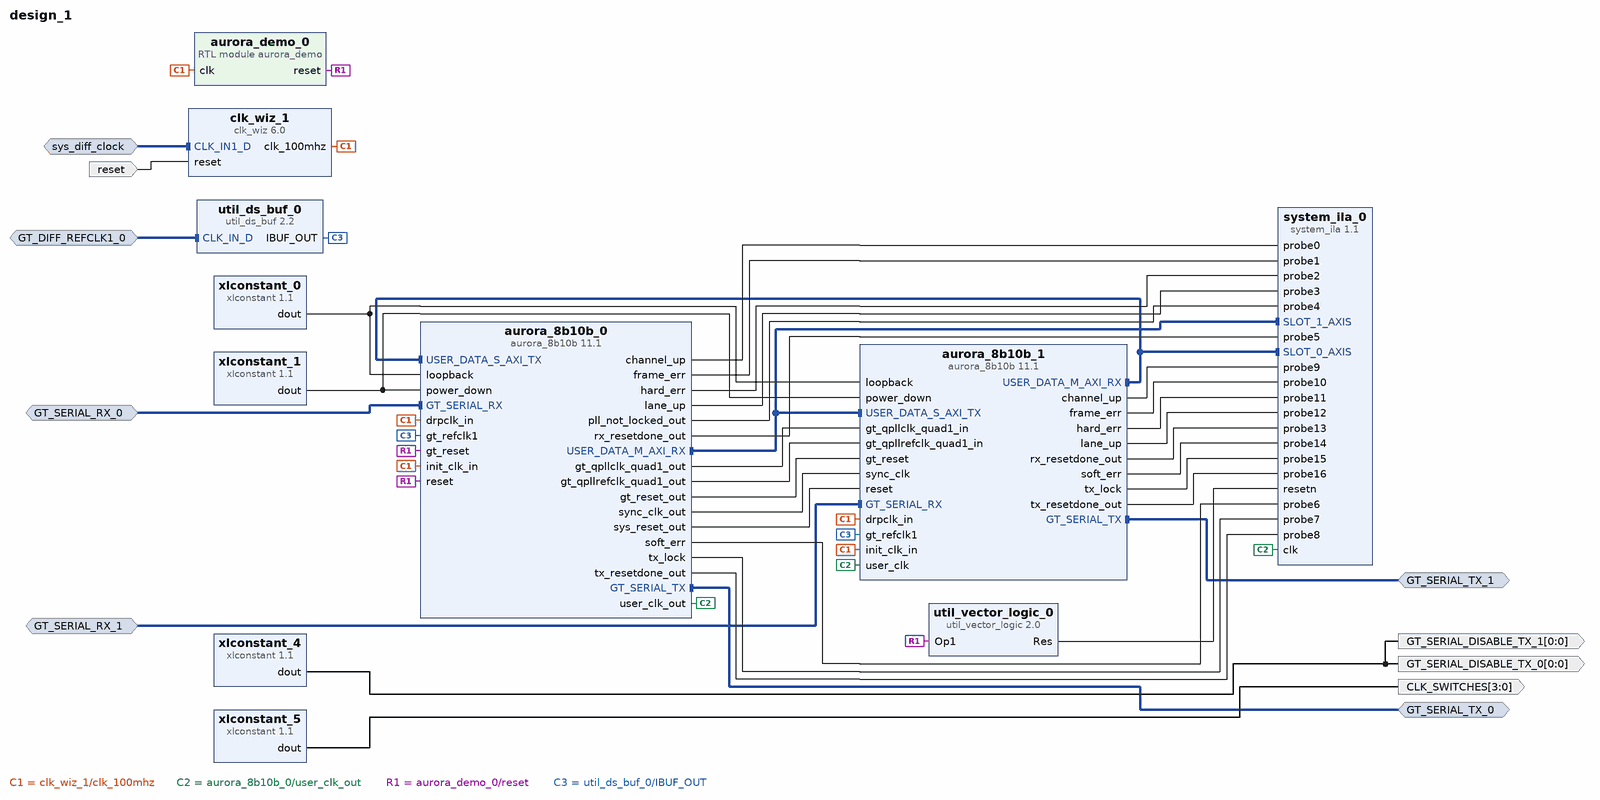
[diagram p0: block diagram of the top level]
# Vivado block design design_1, xc7vx485tffg1761-2, Vivado 2021.1
create_bd_design design_1

create_bd_intf_port -mode Slave -vlnv xilinx.com:display_aurora:GT_Serial_Transceiver_Pins_RX_rtl:1.0 GT_SERIAL_RX_0
create_bd_intf_port -mode Master -vlnv xilinx.com:display_aurora:GT_Serial_Transceiver_Pins_TX_rtl:1.0 GT_SERIAL_TX_0
create_bd_intf_port -mode Slave -vlnv xilinx.com:interface:diff_clock_rtl:1.0 GT_DIFF_REFCLK1_0
set_property -dict {CONFIG.FREQ_HZ 250000000} [get_bd_intf_ports GT_DIFF_REFCLK1_0]
create_bd_intf_port -mode Slave -vlnv xilinx.com:display_aurora:GT_Serial_Transceiver_Pins_RX_rtl:1.0 GT_SERIAL_RX_1
create_bd_intf_port -mode Master -vlnv xilinx.com:display_aurora:GT_Serial_Transceiver_Pins_TX_rtl:1.0 GT_SERIAL_TX_1
create_bd_intf_port -mode Slave -vlnv xilinx.com:interface:diff_clock_rtl:1.0 sys_diff_clock
set_property -dict {CONFIG.FREQ_HZ 200000000} [get_bd_intf_ports sys_diff_clock]
create_bd_port -dir I -type rst reset
set_property -dict {CONFIG.POLARITY ACTIVE_HIGH} [get_bd_ports reset]
create_bd_port -dir O -from 0 -to 0 GT_SERIAL_DISABLE_TX_1
create_bd_port -dir O -from 0 -to 0 GT_SERIAL_DISABLE_TX_0
create_bd_port -dir O -from 3 -to 0 CLK_SWITCHES

create_bd_cell -type ip -vlnv xilinx.com:ip:clk_wiz:6.0 clk_wiz_1
set_property -dict [list \
  CONFIG.CLKIN1_JITTER_PS 50.0 \
  CONFIG.CLKOUT1_JITTER 112.316 \
  CONFIG.CLKOUT1_PHASE_ERROR 89.971 \
  CONFIG.CLK_IN1_BOARD_INTERFACE sys_diff_clock \
  CONFIG.CLK_OUT1_PORT clk_100mhz \
  CONFIG.MMCM_CLKFBOUT_MULT_F 5.000 \
  CONFIG.MMCM_CLKIN1_PERIOD 5.000 \
  CONFIG.MMCM_CLKIN2_PERIOD 10.0 \
  CONFIG.PRIM_IN_FREQ 200.000 \
  CONFIG.PRIM_SOURCE Differential_clock_capable_pin \
  CONFIG.RESET_BOARD_INTERFACE reset \
  CONFIG.USE_BOARD_FLOW true \
] [get_bd_cells clk_wiz_1]
create_bd_cell -type ip -vlnv xilinx.com:ip:xlconstant:1.1 xlconstant_0
set_property -dict {CONFIG.CONST_VAL 0 CONFIG.CONST_WIDTH 3} [get_bd_cells xlconstant_0]
create_bd_cell -type ip -vlnv xilinx.com:ip:xlconstant:1.1 xlconstant_1
set_property -dict {CONFIG.CONST_VAL 0} [get_bd_cells xlconstant_1]
create_bd_cell -type module -reference aurora_demo aurora_demo_0
create_bd_cell -type ip -vlnv xilinx.com:ip:util_ds_buf:2.2 util_ds_buf_0
set_property -dict {CONFIG.C_BUF_TYPE IBUFDSGTE} [get_bd_cells util_ds_buf_0]
create_bd_cell -type ip -vlnv xilinx.com:ip:xlconstant:1.1 xlconstant_4
set_property -dict {CONFIG.CONST_VAL 0} [get_bd_cells xlconstant_4]
create_bd_cell -type ip -vlnv xilinx.com:ip:xlconstant:1.1 xlconstant_5
set_property -dict {CONFIG.CONST_VAL 0b0101 CONFIG.CONST_WIDTH 4} [get_bd_cells xlconstant_5]
create_bd_cell -type ip -vlnv xilinx.com:ip:aurora_8b10b:11.1 aurora_8b10b_0
set_property -dict [list \
  CONFIG.C_DRP_IF false \
  CONFIG.C_GT_CLOCK_1 GTXQ0 \
  CONFIG.C_GT_LOC_1 1 \
  CONFIG.C_GT_LOC_15 X \
  CONFIG.C_GT_LOC_28 X \
  CONFIG.C_LANE_WIDTH 4 \
  CONFIG.C_LINE_RATE 2 \
  CONFIG.C_REFCLK_FREQUENCY 250.000 \
  CONFIG.C_REFCLK_SOURCE none \
  CONFIG.C_START_LANE X0Y0 \
  CONFIG.C_START_QUAD X0Y0 \
  CONFIG.C_USE_CRC false \
  CONFIG.SINGLEEND_GTREFCLK true \
  CONFIG.SINGLEEND_INITCLK true \
  CONFIG.SupportLevel 1 \
] [get_bd_cells aurora_8b10b_0]
create_bd_cell -type ip -vlnv xilinx.com:ip:aurora_8b10b:11.1 aurora_8b10b_1
set_property -dict [list \
  CONFIG.C_DRP_IF false \
  CONFIG.C_GT_CLOCK_1 GTXQ0 \
  CONFIG.C_GT_LOC_1 1 \
  CONFIG.C_GT_LOC_11 X \
  CONFIG.C_GT_LOC_27 X \
  CONFIG.C_LANE_WIDTH 4 \
  CONFIG.C_LINE_RATE 2 \
  CONFIG.C_REFCLK_FREQUENCY 250.000 \
  CONFIG.C_REFCLK_SOURCE none \
  CONFIG.C_START_LANE X0Y0 \
  CONFIG.C_START_QUAD X0Y0 \
  CONFIG.C_USE_CRC false \
  CONFIG.SupportLevel 0 \
] [get_bd_cells aurora_8b10b_1]
create_bd_cell -type ip -vlnv xilinx.com:ip:system_ila:1.1 system_ila_0
set_property -dict [list \
  CONFIG.C_MON_TYPE MIX \
  CONFIG.C_NUM_MONITOR_SLOTS 2 \
  CONFIG.C_NUM_OF_PROBES 17 \
  CONFIG.C_SLOT 1 \
  CONFIG.C_SLOT_0_INTF_TYPE xilinx.com:interface:axis_rtl:1.0 \
  CONFIG.C_SLOT_1_INTF_TYPE xilinx.com:interface:axis_rtl:1.0 \
] [get_bd_cells system_ila_0]
create_bd_cell -type ip -vlnv xilinx.com:ip:util_vector_logic:2.0 util_vector_logic_0
set_property -dict {CONFIG.C_OPERATION not CONFIG.C_SIZE 1} [get_bd_cells util_vector_logic_0]

# ---- connections ----

connect_bd_intf_net -intf_net GT_DIFF_REFCLK1_0_1 [get_bd_intf_ports GT_DIFF_REFCLK1_0] [get_bd_intf_pins util_ds_buf_0/CLK_IN_D]
connect_bd_intf_net -intf_net GT_SERIAL_RX_0_1 [get_bd_intf_ports GT_SERIAL_RX_0] [get_bd_intf_pins aurora_8b10b_0/GT_SERIAL_RX]
connect_bd_intf_net -intf_net GT_SERIAL_RX_1_1 [get_bd_intf_ports GT_SERIAL_RX_1] [get_bd_intf_pins aurora_8b10b_1/GT_SERIAL_RX]
connect_bd_intf_net [get_bd_intf_ports GT_SERIAL_TX_0] [get_bd_intf_pins aurora_8b10b_0/GT_SERIAL_TX]
connect_bd_intf_net [get_bd_intf_pins aurora_8b10b_0/USER_DATA_M_AXI_RX] [get_bd_intf_pins aurora_8b10b_1/USER_DATA_S_AXI_TX]
connect_bd_intf_net [get_bd_intf_pins aurora_8b10b_0/USER_DATA_M_AXI_RX] [get_bd_intf_pins system_ila_0/SLOT_1_AXIS]
connect_bd_intf_net [get_bd_intf_ports GT_SERIAL_TX_1] [get_bd_intf_pins aurora_8b10b_1/GT_SERIAL_TX]
connect_bd_intf_net [get_bd_intf_pins aurora_8b10b_1/USER_DATA_M_AXI_RX] [get_bd_intf_pins aurora_8b10b_0/USER_DATA_S_AXI_TX]
connect_bd_intf_net [get_bd_intf_pins aurora_8b10b_1/USER_DATA_M_AXI_RX] [get_bd_intf_pins system_ila_0/SLOT_0_AXIS]
connect_bd_intf_net [get_bd_intf_ports sys_diff_clock] [get_bd_intf_pins clk_wiz_1/CLK_IN1_D]
connect_bd_net [get_bd_pins clk_wiz_1/clk_100mhz] \
  [get_bd_pins aurora_demo_0/clk] [get_bd_pins aurora_8b10b_0/drpclk_in] [get_bd_pins aurora_8b10b_0/init_clk_in] \
  [get_bd_pins aurora_8b10b_1/drpclk_in] [get_bd_pins aurora_8b10b_1/init_clk_in]
connect_bd_net [get_bd_pins aurora_8b10b_0/channel_up] [get_bd_pins system_ila_0/probe0]
connect_bd_net [get_bd_pins aurora_8b10b_0/frame_err] [get_bd_pins system_ila_0/probe1]
connect_bd_net [get_bd_pins aurora_8b10b_0/gt_qpllclk_quad1_out] [get_bd_pins aurora_8b10b_1/gt_qpllclk_quad1_in]
connect_bd_net [get_bd_pins aurora_8b10b_0/gt_qpllrefclk_quad1_out] [get_bd_pins aurora_8b10b_1/gt_qpllrefclk_quad1_in]
connect_bd_net [get_bd_pins aurora_8b10b_0/gt_reset_out] [get_bd_pins aurora_8b10b_1/gt_reset]
connect_bd_net [get_bd_pins aurora_8b10b_0/hard_err] [get_bd_pins system_ila_0/probe2]
connect_bd_net [get_bd_pins aurora_8b10b_0/lane_up] [get_bd_pins system_ila_0/probe3]
connect_bd_net [get_bd_pins aurora_8b10b_0/pll_not_locked_out] [get_bd_pins system_ila_0/probe4]
connect_bd_net [get_bd_pins aurora_8b10b_0/rx_resetdone_out] [get_bd_pins system_ila_0/probe5]
connect_bd_net [get_bd_pins aurora_8b10b_0/soft_err] [get_bd_pins system_ila_0/probe6]
connect_bd_net [get_bd_pins aurora_8b10b_0/sync_clk_out] [get_bd_pins aurora_8b10b_1/sync_clk]
connect_bd_net [get_bd_pins aurora_8b10b_0/sys_reset_out] [get_bd_pins aurora_8b10b_1/reset]
connect_bd_net [get_bd_pins aurora_8b10b_0/tx_lock] [get_bd_pins system_ila_0/probe7]
connect_bd_net [get_bd_pins aurora_8b10b_0/tx_resetdone_out] [get_bd_pins system_ila_0/probe8]
connect_bd_net [get_bd_pins aurora_8b10b_0/user_clk_out] [get_bd_pins aurora_8b10b_1/user_clk] [get_bd_pins system_ila_0/clk]
connect_bd_net [get_bd_pins aurora_8b10b_1/channel_up] [get_bd_pins system_ila_0/probe9]
connect_bd_net [get_bd_pins aurora_8b10b_1/frame_err] [get_bd_pins system_ila_0/probe10]
connect_bd_net [get_bd_pins aurora_8b10b_1/hard_err] [get_bd_pins system_ila_0/probe11]
connect_bd_net [get_bd_pins aurora_8b10b_1/lane_up] [get_bd_pins system_ila_0/probe12]
connect_bd_net [get_bd_pins aurora_8b10b_1/rx_resetdone_out] [get_bd_pins system_ila_0/probe13]
connect_bd_net [get_bd_pins aurora_8b10b_1/soft_err] [get_bd_pins system_ila_0/probe14]
connect_bd_net [get_bd_pins aurora_8b10b_1/tx_lock] [get_bd_pins system_ila_0/probe15]
connect_bd_net [get_bd_pins aurora_8b10b_1/tx_resetdone_out] [get_bd_pins system_ila_0/probe16]
connect_bd_net [get_bd_pins aurora_demo_0/reset] \
  [get_bd_pins aurora_8b10b_0/reset] [get_bd_pins aurora_8b10b_0/gt_reset] [get_bd_pins util_vector_logic_0/Op1]
connect_bd_net [get_bd_ports reset] [get_bd_pins clk_wiz_1/reset]
connect_bd_net [get_bd_pins util_ds_buf_0/IBUF_OUT] [get_bd_pins aurora_8b10b_0/gt_refclk1] [get_bd_pins aurora_8b10b_1/gt_refclk1]
connect_bd_net [get_bd_pins util_vector_logic_0/Res] [get_bd_pins system_ila_0/resetn]
connect_bd_net [get_bd_pins xlconstant_0/dout] [get_bd_pins aurora_8b10b_0/loopback] [get_bd_pins aurora_8b10b_1/loopback]
connect_bd_net [get_bd_pins xlconstant_1/dout] [get_bd_pins aurora_8b10b_0/power_down] [get_bd_pins aurora_8b10b_1/power_down]
connect_bd_net [get_bd_pins xlconstant_4/dout] [get_bd_ports GT_SERIAL_DISABLE_TX_0] [get_bd_ports GT_SERIAL_DISABLE_TX_1]
connect_bd_net [get_bd_pins xlconstant_5/dout] [get_bd_ports CLK_SWITCHES]

validate_bd_design
save_bd_design
